# EAGLE design Next_Make_CPW_2015 (EAGLE 7.0.0)
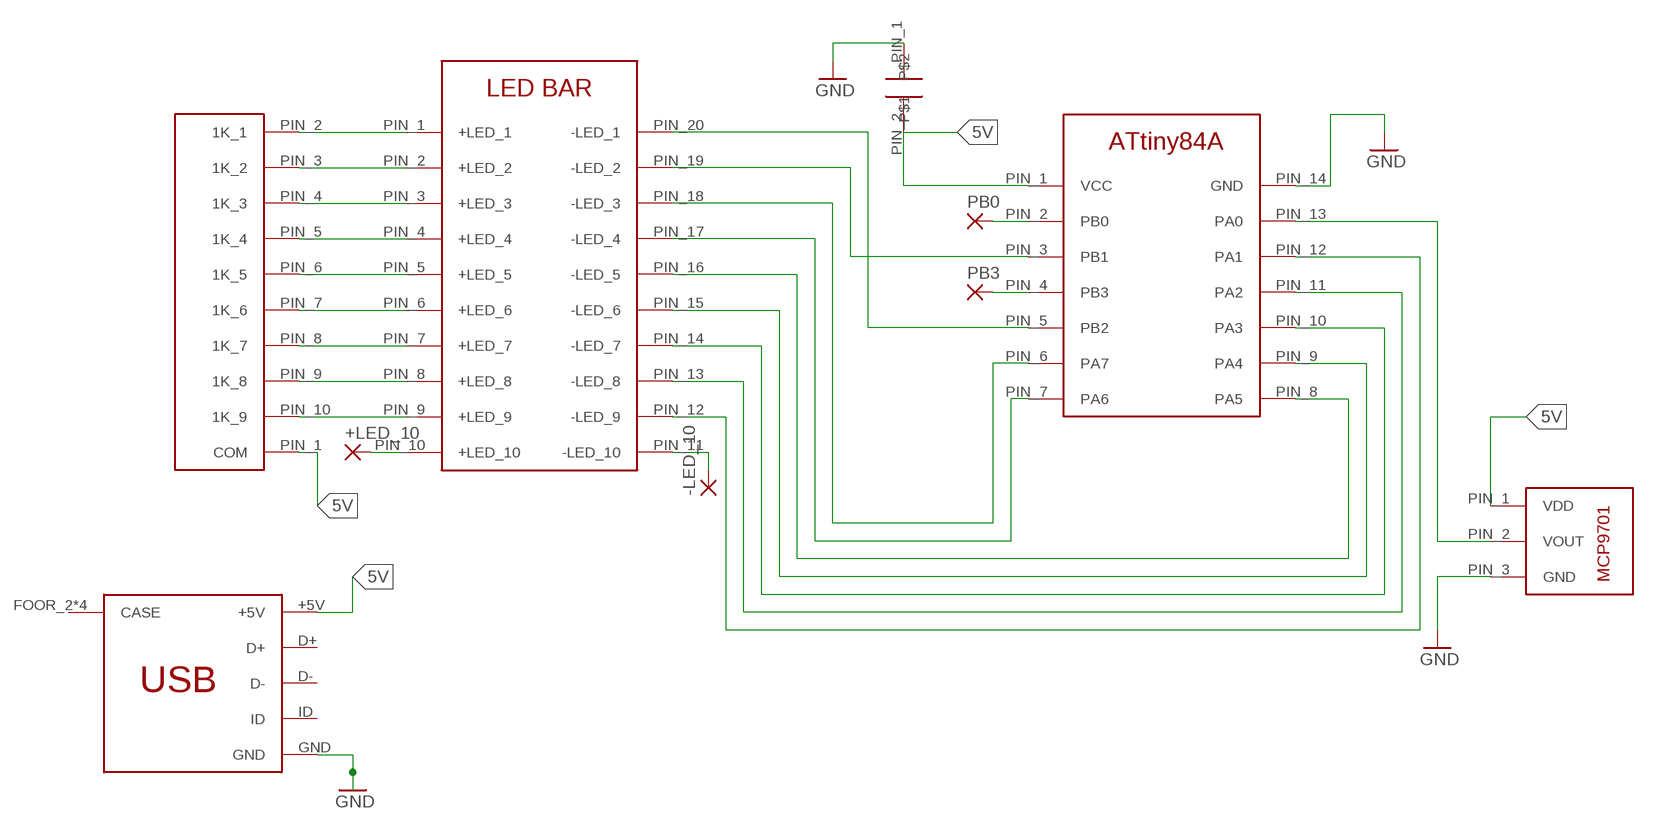
[diagram p0: schematic, sheet 1]

## Parts
+LED_10  SMD2  [SMD1,27-2,54]
-LED_10  SMD2  [SMD1,27-2,54]
PB0  SMD2  [SMD1,27-2,54]
PB3  SMD2  [SMD1,27-2,54]
U$1  9X_1K_BUSSED_R  [SIP-10]
U$2  10UF_FK18  [CAP_FK18]
U$3  ATTINY84A  [PDIP-14]
U$4  LED_X10_BAR  [LED_X10_BAR]
U$5  MCP9701  [TO-92-3]
U$6  USB_MINI  [SMT_MINI_USB]

## Nets
5V: U$1.PIN_1(COM) U$2.PIN_2 U$3.PIN_1(VCC) U$5.PIN_1(VDD) U$6.+5V
GND: U$2.PIN_1 U$3.PIN_14(GND) U$5.PIN_3(GND) U$6.GND
N$1: U$1.PIN_2(1K_1) U$4.PIN_1(+LED_1)
N$2: U$1.PIN_3(1K_2) U$4.PIN_2(+LED_2)
N$3: U$1.PIN_4(1K_3) U$4.PIN_3(+LED_3)
N$4: U$1.PIN_5(1K_4) U$4.PIN_4(+LED_4)
N$5: U$1.PIN_6(1K_5) U$4.PIN_5(+LED_5)
N$6: U$1.PIN_7(1K_6) U$4.PIN_6(+LED_6)
N$7: U$1.PIN_8(1K_7) U$4.PIN_7(+LED_7)
N$8: U$1.PIN_9(1K_8) U$4.PIN_8(+LED_8)
N$9: U$1.PIN_10(1K_9) U$4.PIN_9(+LED_9)
N$10: U$3.PIN_13(PA0) U$5.PIN_2(VOUT)
N$11: U$3.PIN_11(PA2) U$4.PIN_13(-LED_8)
N$12: U$3.PIN_12(PA1) U$4.PIN_12(-LED_9)
N$13: U$3.PIN_10(PA3) U$4.PIN_14(-LED_7)
N$14: U$3.PIN_9(PA4) U$4.PIN_15(-LED_6)
N$15: U$3.PIN_8(PA5) U$4.PIN_16(-LED_5)
N$16: U$3.PIN_7(PA6) U$4.PIN_17(-LED_4)
N$17: U$3.PIN_6(PA7) U$4.PIN_18(-LED_3)
N$18: U$3.PIN_3(PB1) U$4.PIN_19(-LED_2)
N$19: U$3.PIN_5(PB2) U$4.PIN_20(-LED_1)
N$20: +LED_10.1(P) U$4.PIN_10(+LED_10)
N$21: -LED_10.1(P) U$4.PIN_11(-LED_10)
N$22: PB0.1(P) U$3.PIN_2(PB0)
N$23: PB3.1(P) U$3.PIN_4(PB3)
Unconnected: U$6.D+ U$6.D- U$6.FOOR_2(CASE) U$6.FOOT_1(CASE) U$6.FOOT_3(CASE) U$6.FOOT_4(CASE) U$6.ID

## Library data of the parts
+LED_10 -LED_10 PB0 PB3 = wirepad:SMD2: SMD PAD
U$1 = Next_Make_CPW_2015:9X_1K_BUSSED_R
U$2 = Next_Make_CPW_2015:10UF_FK18
U$3 = Next_Make_CPW_2015:ATTINY84A
U$4 = Next_Make_CPW_2015:LED_X10_BAR
U$5 = Next_Make_CPW_2015:MCP9701
U$6 = Next_Make_CPW_2015:USB_MINI

## Board
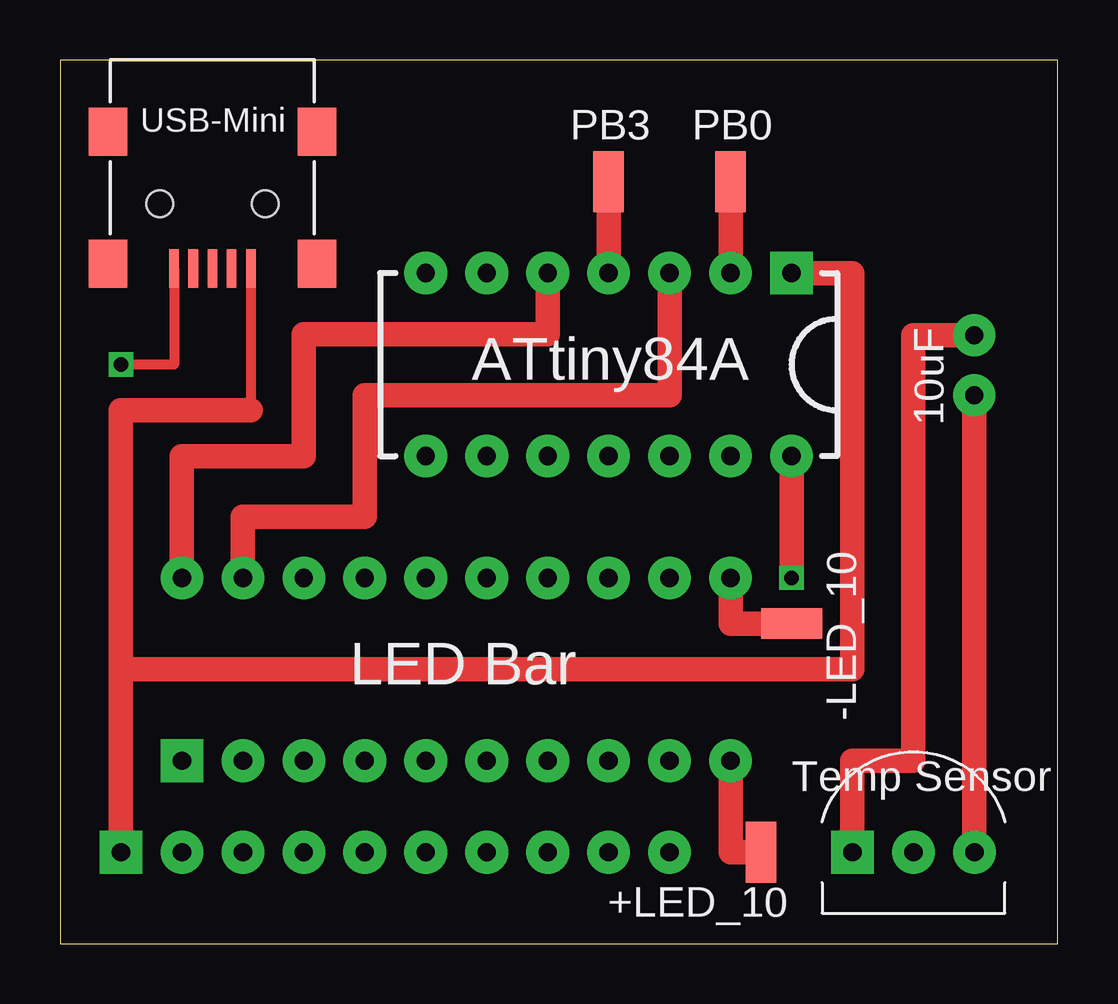
[diagram p1: board, top side]
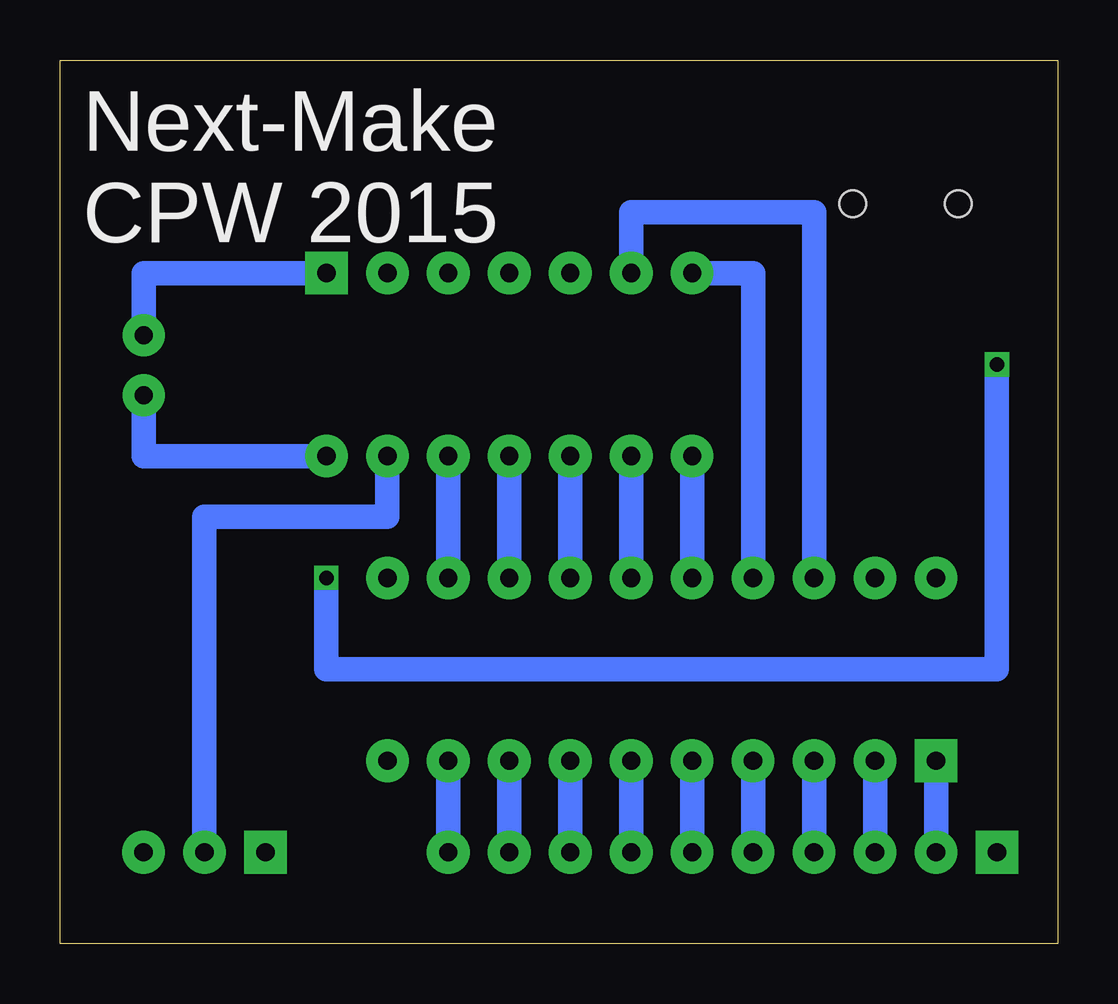
[diagram p2: board, bottom side, seen from below]

Size 41.58 x 36.82 mm. Coordinates in mm from the lower left corner, seen from the top.
Outline: 0,0 41.58,0 41.58,36.82 0,36.82 0,0
Copper layers (1*16): Top 0.035mm / dielectric 1.5mm / Bottom 0.035mm
Design rules "default": minimum track width 10mil, minimum drill 24mil, track to track 8mil, track to pad 8mil, pad to pad 8mil, via to via 8mil, smd to smd 8mil, copper to edge 40mil, drill to drill 8mil, minimum pad ring 10mil, minimum via ring 8mil, stop-mask expansion 4mil, vias tented up to drill 0mil, thermal gap 10mil

### Footprints (pad centres in the part's own frame; a part is rotated, then mirrored left to right if it is on the bottom)
SMD1,27-2,54 = smd 1.27 x 2.54: 1 0,0
SIP-10 = drill 0.762 pad 1.778 square: PIN_1 0,0 | drill 0.762 pad 1.778: PIN_2 0,-2.54; PIN_3 0,-5.08; PIN_4 0,-7.62; PIN_5 0,-10.16; PIN_6 0,-12.7; PIN_7 0,-15.24; PIN_8 0,-17.78; PIN_9 0,-20.32; PIN_10 0,-22.86
CAP_FK18 = drill 0.75 pad 1.75: PIN_1 0,0; PIN_2 2.5,0
PDIP-14 = drill 0.762 pad 1.778 square: PIN_1 0,15.24 | drill 0.762 pad 1.778: PIN_2 0,12.7; PIN_3 0,10.16; PIN_4 0,7.62; PIN_5 0,5.08; PIN_6 0,2.54; PIN_7 0,0; PIN_8 7.62,0; PIN_9 7.62,2.54; PIN_10 7.62,5.08; PIN_11 7.62,7.62; PIN_12 7.62,10.16; PIN_13 7.62,12.7; PIN_14 7.62,15.24
LED_X10_BAR = drill 0.762 pad 1.778 square: PIN_1 0,0 | drill 0.762 pad 1.778: PIN_2 0,-2.54; PIN_3 0,-5.08; PIN_4 0,-7.62; PIN_5 0,-10.16; PIN_6 0,-12.7; PIN_7 0,-15.24; PIN_8 0,-17.78; PIN_9 0,-20.32; PIN_10 0,-22.86; PIN_11 7.62,-22.86; PIN_12 7.62,-20.32; PIN_13 7.62,-17.78; PIN_14 7.62,-15.24; PIN_15 7.62,-12.7; PIN_16 7.62,-10.16; PIN_17 7.62,-7.62; PIN_18 7.62,-5.08; PIN_19 7.62,-2.54; PIN_20 7.62,0
TO-92-3 = drill 0.762 pad 1.778 square: PIN_1 0,0 | drill 0.762 pad 1.778: PIN_2 2.54,0; PIN_3 5.08,0
SMT_MINI_USB = smd 1.6 x 0.4: +5V 8.7,1.6; D+ 8.7,0; D- 8.7,0.8; GND 8.7,-1.6; ID 8.7,-0.8 | smd 2 x 1.6: FOOR_2 8.5,-4.35; FOOT_1 3,-4.35; FOOT_3 8.5,4.35; FOOT_4 3,4.35 | hole 1.1: 6,-2.2; 6,2.2

### Placement (x,y rotation side)
+LED_10  29.21,3.81 0 top
-LED_10  30.48,13.34 90 top
PB0  27.94,31.75 0 top
PB3  22.86,31.75 0 top
U$1  2.54,3.81 90 top
U$2  38.1,22.86 90 top
U$3  15.24,27.94 270 top
U$4  5.08,7.62 90 top
U$5  33.02,3.81 0 top
U$6  6.35,36.83 270 top

### Tracks (layer width: path | path; a pad name or v marks a point on that pad's centre or on a via)
5V
  Top 0.406: U$6.+5V 7.95,22.23
  Top 1.016: 38.1,25.4 U$2.PIN_2 35.56,25.36 35.56,7.62 33.02,7.62 U$5.PIN_1 | 7.95,22.23 2.54,22.23 2.54,11.43 | 2.54,11.43 U$1.PIN_1 | U$3.PIN_1 33.02,27.94 33.02,11.43 2.54,11.43
  Bottom 1.016: U$3.PIN_1 38.1,27.94 U$2.PIN_2
GND  (via drill 0.6)
  Top 0.406: U$6.GND 4.75,24.13 v2.54,24.13
  Top 1.016: U$5.PIN_3 U$2.PIN_1 | v30.48,15.24 U$3.PIN_14
  Bottom 1.016: U$3.PIN_14 38.1,20.32 U$2.PIN_1 | v2.54,24.13 2.54,11.43 30.48,11.43 v30.48,15.24
N$1
  Bottom 1.016: U$4.PIN_1 U$1.PIN_2
N$2
  Bottom 1.016: U$4.PIN_2 U$1.PIN_3
N$3
  Bottom 1.016: U$4.PIN_3 U$1.PIN_4
N$4
  Bottom 1.016: U$4.PIN_4 U$1.PIN_5
N$5
  Bottom 1.016: U$4.PIN_5 U$1.PIN_6
N$6
  Bottom 1.016: U$4.PIN_6 U$1.PIN_7
N$7
  Bottom 1.016: U$4.PIN_7 U$1.PIN_8
N$8
  Bottom 1.016: U$4.PIN_8 U$1.PIN_9
N$9
  Bottom 1.016: U$4.PIN_9 U$1.PIN_10
N$10
  Bottom 1.016: U$3.PIN_13 27.94,17.78 35.56,17.78 U$5.PIN_2
N$11
  Bottom 1.016: U$3.PIN_11 U$4.PIN_13
N$12
  Bottom 1.016: U$3.PIN_12 U$4.PIN_12
N$13
  Bottom 1.016: U$3.PIN_10 U$4.PIN_14
N$14
  Bottom 1.016: U$3.PIN_9 U$4.PIN_15
N$15
  Bottom 1.016: U$3.PIN_8 U$4.PIN_16
N$16
  Bottom 1.016: U$3.PIN_7 12.7,27.94 U$4.PIN_17
N$17
  Bottom 1.016: U$3.PIN_6 17.78,30.48 10.16,30.48 U$4.PIN_18
N$18
  Top 1.016: U$3.PIN_3 25.4,22.86 12.7,22.86 12.7,17.78 7.62,17.78 U$4.PIN_19
N$19
  Top 1.016: U$3.PIN_5 20.32,25.4 10.16,25.4 10.16,20.32 5.08,20.32 U$4.PIN_20
N$20
  Top 1.016: U$4.PIN_10 27.94,3.81 +LED_10.1
N$21
  Top 1.016: U$4.PIN_11 27.94,13.34 -LED_10.1
N$22
  Top 1.016: U$3.PIN_2 PB0.1
N$23
  Top 1.016: U$3.PIN_4 PB3.1

### Text on the board
tPlace: ATtiny84A | 10uF | LED Bar | Temp Sensor
bPlace: Next-Make | CPW 2015